# EAGLE schematic main controler-old (EAGLE 9.4.2)
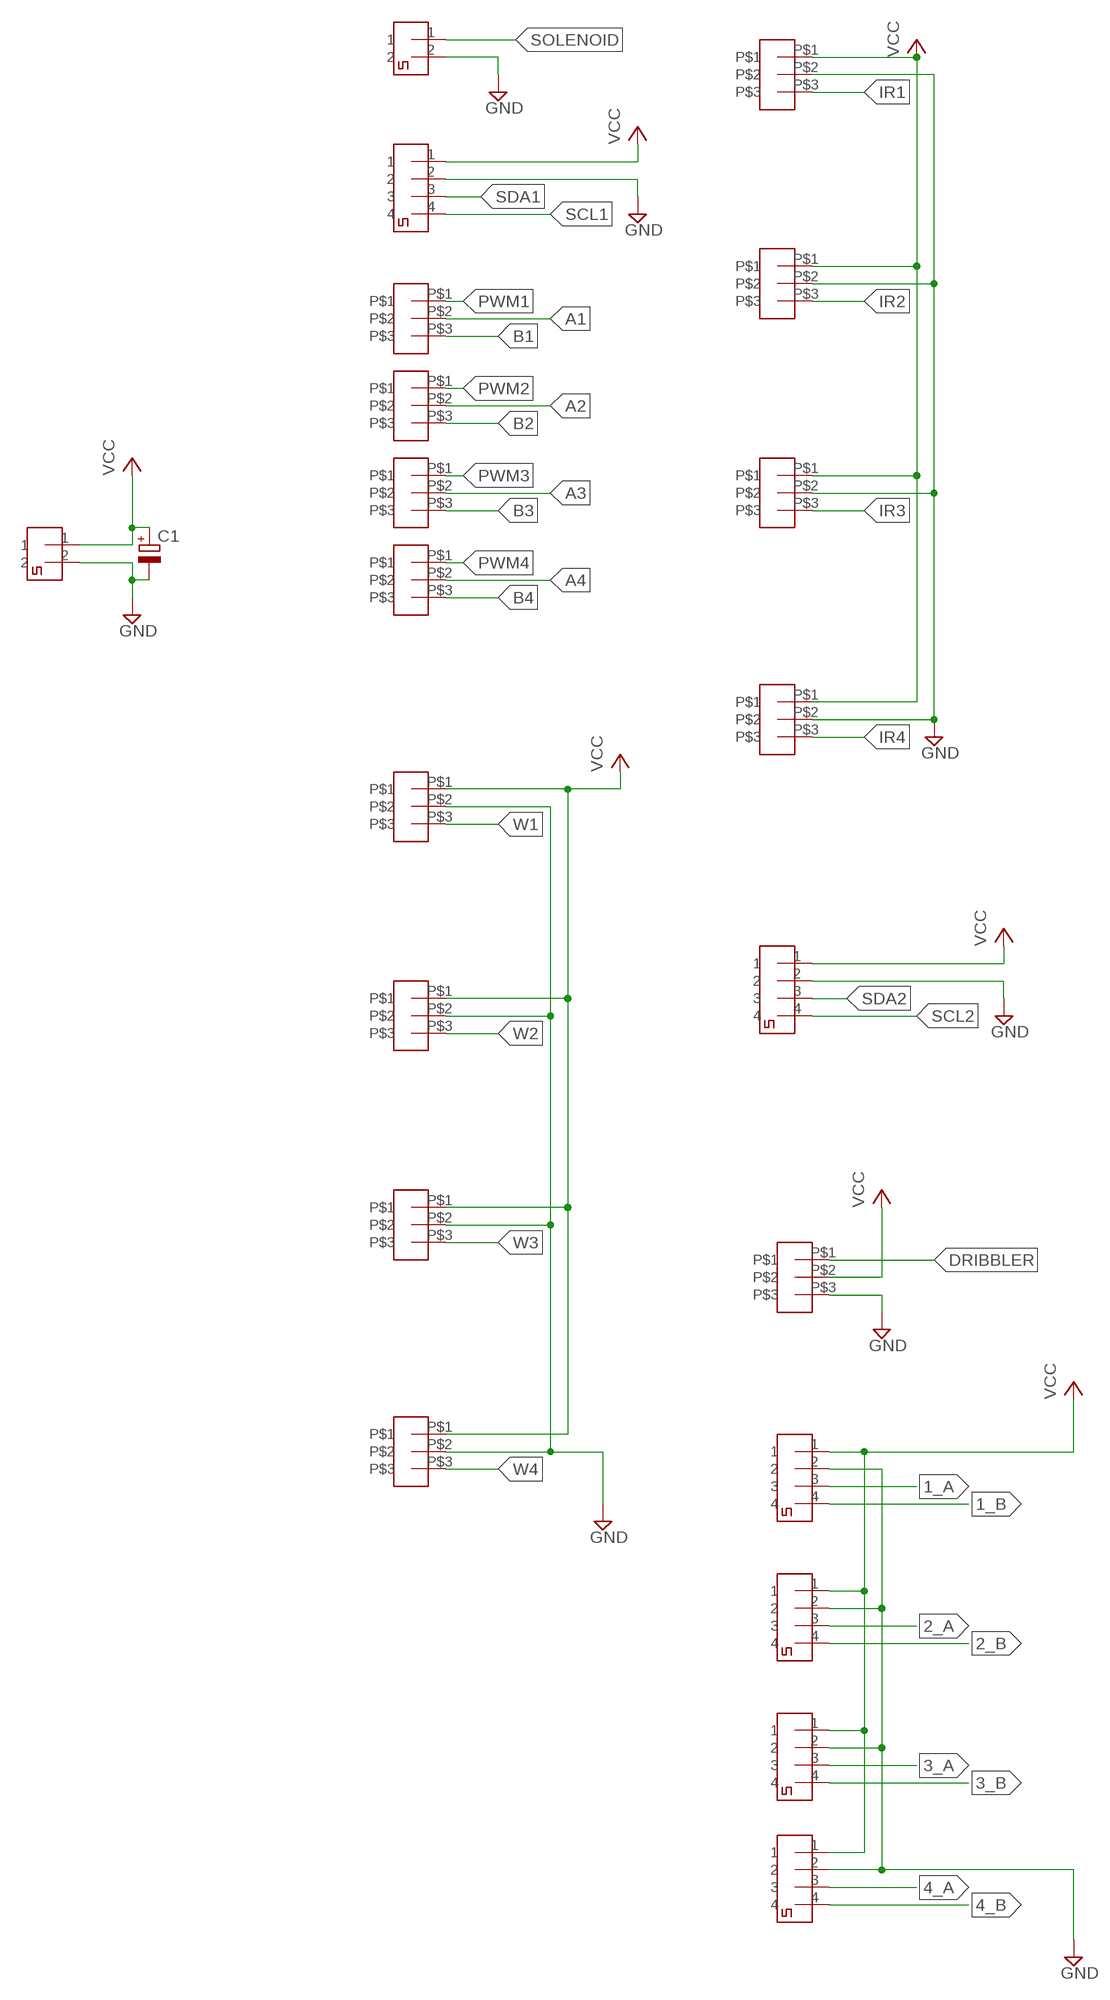
[diagram p0: schematic, sheet 1, part 1 of 2]
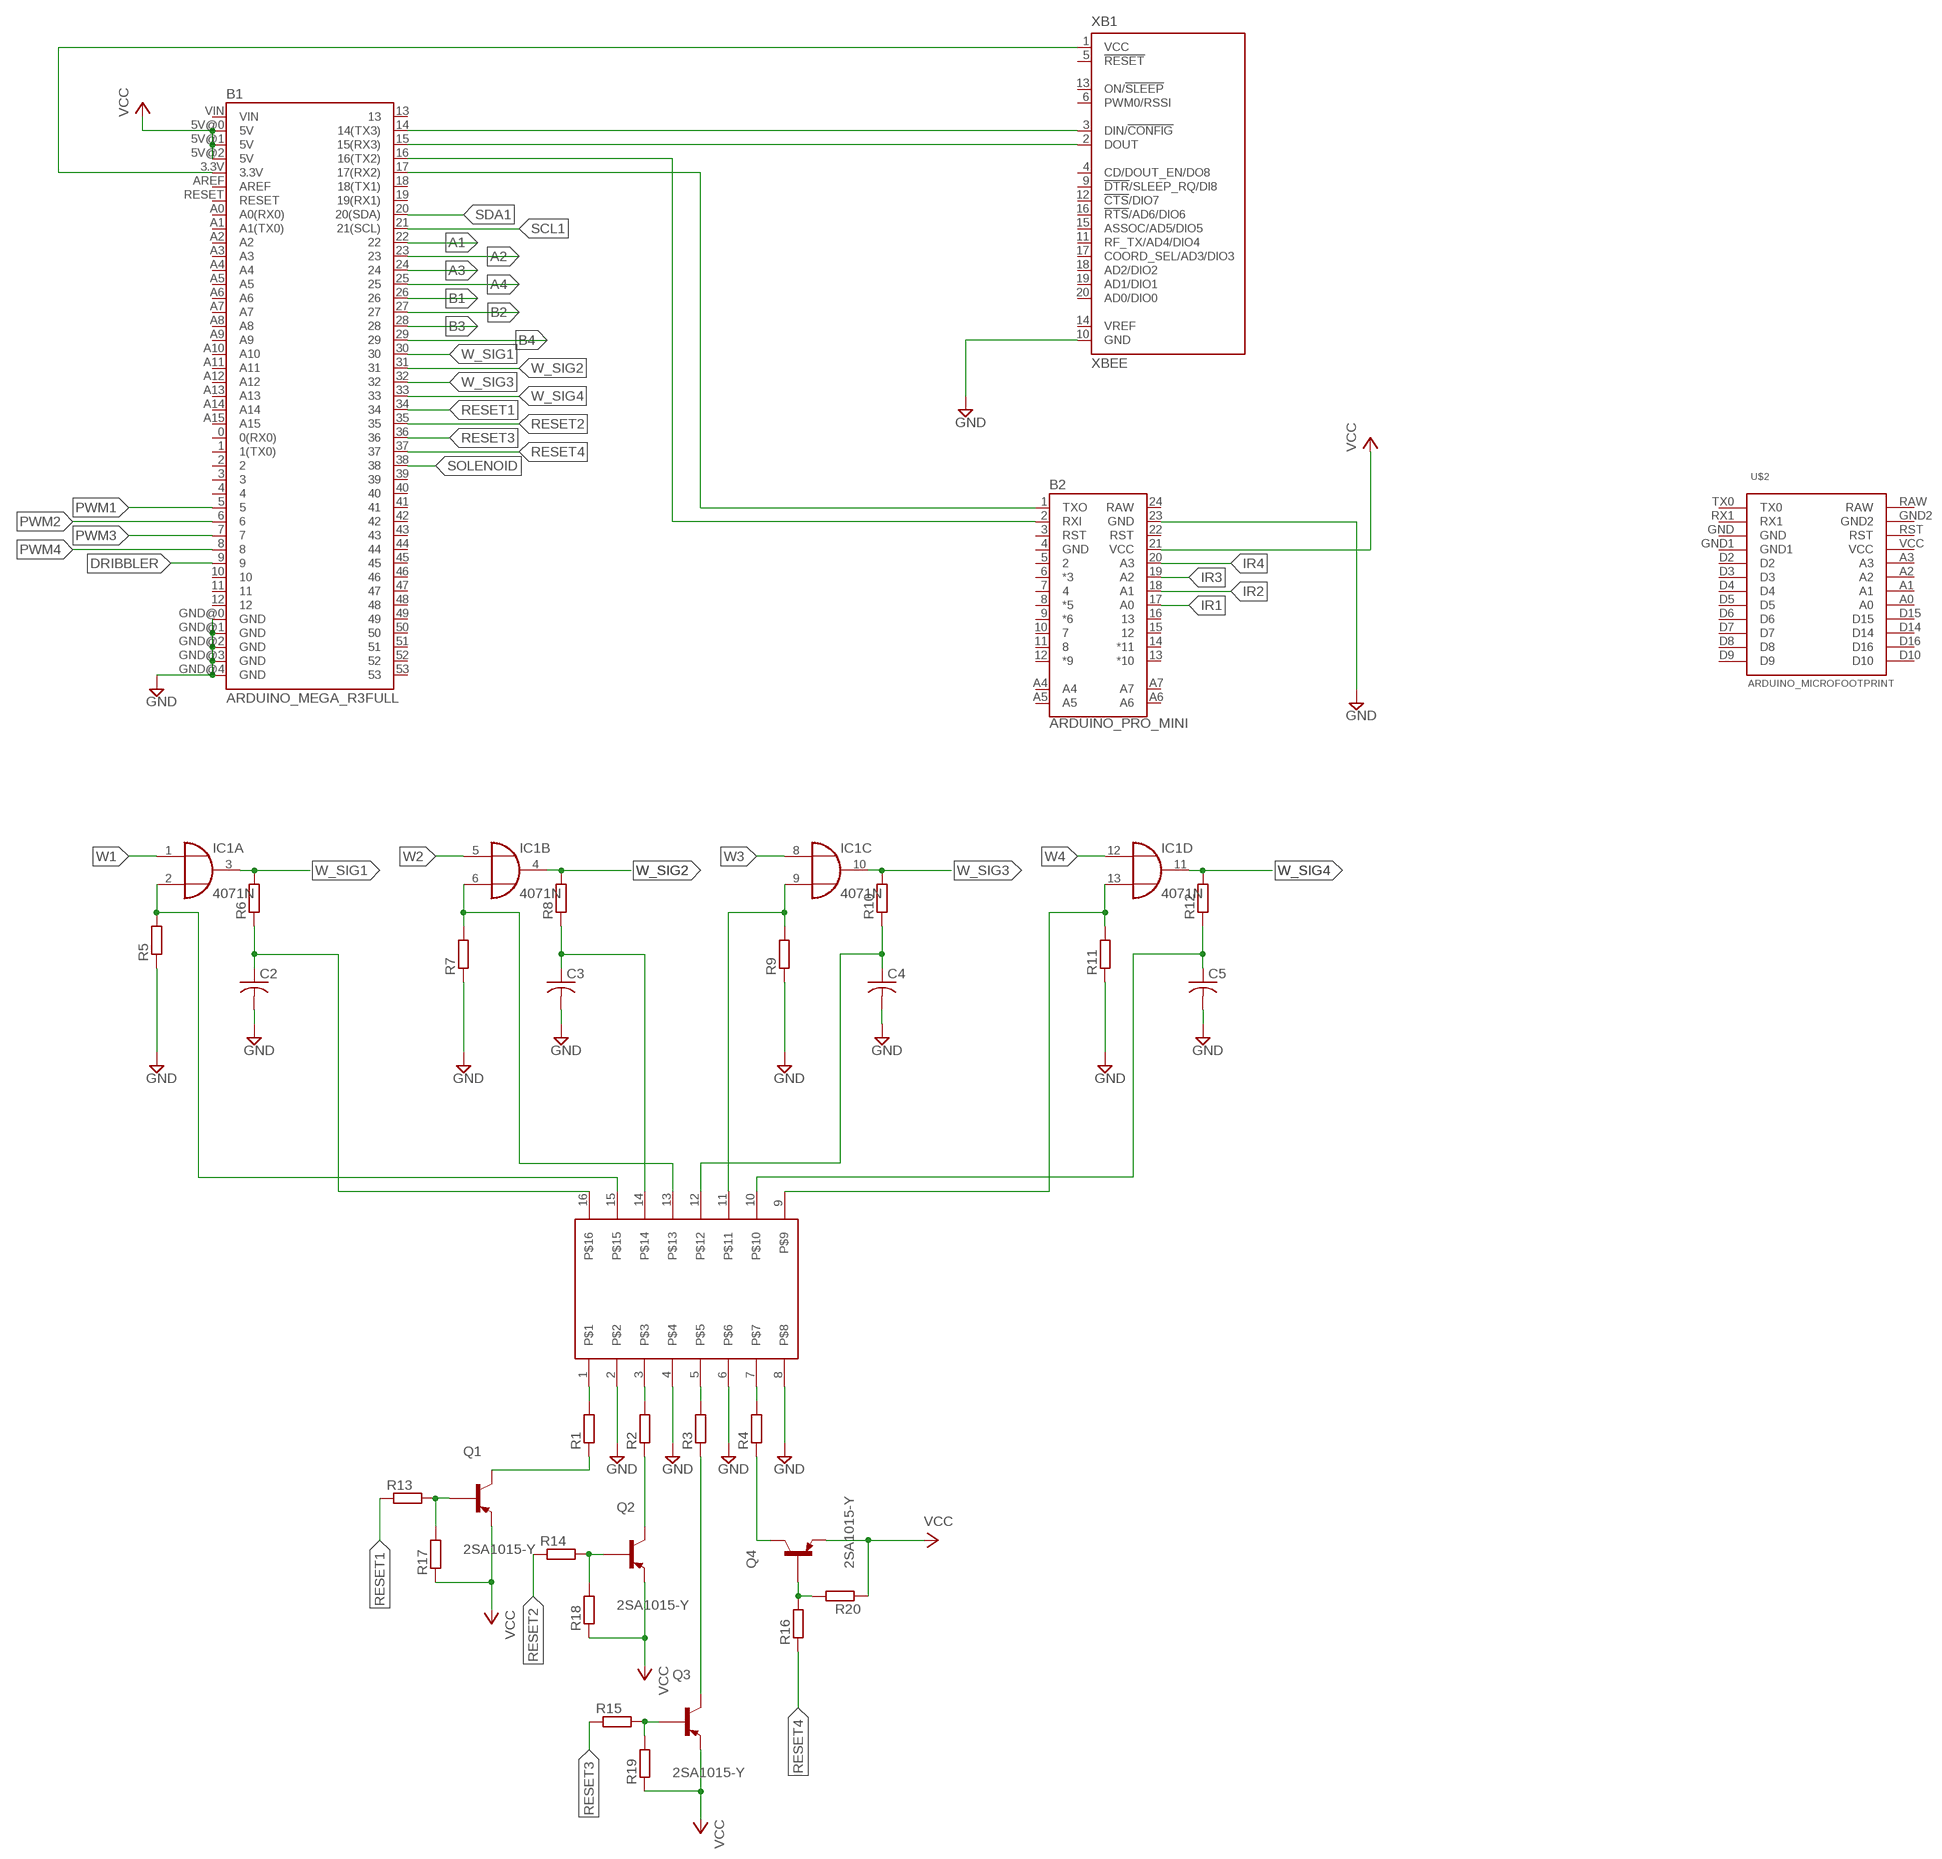
[diagram p1: schematic, sheet 1, part 2 of 2]

## Parts
5V_IN  2PIN  [2PIN]
B1  ARDUINO_MEGA_R3FULL  [ARDUINO_MEGA]
B2  ARDUINO_PRO_MINI  [ARDUINO_PRO_MINI]
C1  CPOL-EUE2-5  [E2-5]
C2  C-US050-024X044  [C050-024X044]
C3  C-US050-024X044  [C050-024X044]
C4  C-US050-024X044  [C050-024X044]
C5  C-US050-024X044  [C050-024X044]
CONNECTOR2  2PIN  [2PIN]
DRIBBLER  3PIN  [3PIN]
ENCODER1  2PIN  [2PIN]
ENCODER2  2PIN  [2PIN]
ENCODER3  2PIN  [2PIN]
ENCODER4  2PIN  [2PIN]
I2C_MEGA  2PIN  [2PIN]
IC1  4071N  [DIL14]
IR_DISTANCE1  3PIN  [3PIN]
IR_DISTANCE2  3PIN  [3PIN]
IR_DISTANCE3  3PIN  [3PIN]
IR_DISTANCE4  3PIN  [3PIN]
MOTOR1  3PIN  [3PIN]
MOTOR2  3PIN  [3PIN]
MOTOR3  3PIN  [3PIN]
MOTOR4  3PIN  [3PIN]
Q1  2SA1015-Y  [TO92127P510H650-3]
Q2  2SA1015-Y  [TO92127P510H650-3]
Q3  2SA1015-Y  [TO92127P510H650-3]
Q4  2SA1015-Y  [TO92127P510H650-3]
R1  R-EU_0204/7  [0204/7]
R2  R-EU_0204/7  [0204/7]
R3  R-EU_0204/7  [0204/7]
R4  R-EU_0204/7  [0204/7]
R5  R-EU_0204/7  [0204/7]
R6  R-EU_0204/7  [0204/7]
R7  R-EU_0204/7  [0204/7]
R8  R-EU_0204/7  [0204/7]
R9  R-EU_0204/7  [0204/7]
R10  R-EU_0204/7  [0204/7]
R11  R-EU_0204/7  [0204/7]
R12  R-EU_0204/7  [0204/7]
R13  R-EU_0204/7  [0204/7]
R14  R-EU_0204/7  [0204/7]
R15  R-EU_0204/7  [0204/7]
R16  R-EU_0204/7  [0204/7]
R17  R-EU_0204/7  [0204/7]
R18  R-EU_0204/7  [0204/7]
R19  R-EU_0204/7  [0204/7]
R20  R-EU_0204/7  [0204/7]
SOLENOID  2PIN  [2PIN]
U$1  TLP627-4  [DIP254P762X432-16P]
U$2  ARDUINO_MICROFOOTPRINT  [ARDUINO-MICRO]
WHITE1  3PIN  [3PIN]
WHITE2  3PIN  [3PIN]
WHITE3  3PIN  [3PIN]
WHITE4  3PIN  [3PIN]
XB1  XBEE  [XBEE]

## Nets
1_A: ENCODER1.3
1_B: ENCODER1.4
2_A: ENCODER2.3
2_B: ENCODER2.4
3_A: ENCODER3.3
3_B: ENCODER3.4
4_A: ENCODER4.3
4_B: ENCODER4.4
A1: B1.22 MOTOR1.P$2
A2: B1.23 MOTOR2.P$2
A3: B1.24 MOTOR3.P$2
A4: B1.25 MOTOR4.P$2
B1: B1.26 MOTOR1.P$3
B2: B1.27 MOTOR2.P$3
B3: B1.28 MOTOR3.P$3
B4: B1.29 MOTOR4.P$3
DRIBBLER: B1.9 DRIBBLER.P$1
GND: 5V_IN.2 B1.GND@0(GND) B1.GND@1(GND) B1.GND@2(GND) B1.GND@3(GND) B1.GND@4(GND) B2.23(GND) C1.- C2.2 C3.2 C4.2 C5.2 CONNECTOR2.2 DRIBBLER.P$3 ENCODER1.2 ENCODER2.2 ENCODER3.2 ENCODER4.2 I2C_MEGA.2 IR_DISTANCE1.P$2 IR_DISTANCE2.P$2 IR_DISTANCE3.P$2 IR_DISTANCE4.P$2 R5.1 R7.1 R9.1 R11.1 SOLENOID.2 U$1.2 U$1.4 U$1.6 U$1.8 WHITE1.P$2 WHITE2.P$2 WHITE3.P$2 WHITE4.P$2 XB1.10(GND)
IR1: B2.17(A0) IR_DISTANCE1.P$3
IR2: B2.18(A1) IR_DISTANCE2.P$3
IR3: B2.19(A2) IR_DISTANCE3.P$3
IR4: B2.20(A3) IR_DISTANCE4.P$3
N$1: B1.3.3V XB1.1(VCC)
N$2: B1.15(15(RX3)) XB1.2(DOUT)
N$3: B1.17(17(RX2)) B2.1(TXO)
N$4: B1.16(16(TX2)) B2.2(RXI)
N$5: B1.14(14(TX3)) XB1.3(DIN/!CONFIG)
N$8: IC1.2(A:I1) R5.2 U$1.15
N$9: IC1.6(B:I1) R7.2 U$1.13
N$10: C3.1 R8.1 U$1.14
N$11: C2.1 R6.1 U$1.16
N$12: C4.1 R10.1 U$1.12
N$14: IC1.9(C:I1) R9.2 U$1.11
N$15: IC1.13(D:I1) R11.2 U$1.9
N$17: C5.1 R12.1 U$1.10
N$18: Q1.2(C) R1.1
N$19: Q2.2(C) R2.1
N$20: R1.2 U$1.1
N$21: R2.2 U$1.3
N$22: R4.2 U$1.7
N$23: R3.2 U$1.5
N$24: Q3.2(C) R3.1
N$25: Q4.2(C) R4.1
N$26: Q1.3(B) R13.2 R17.2
N$27: Q2.3(B) R14.2 R18.2
N$28: Q4.3(B) R16.2 R20.2
N$29: Q3.3(B) R15.2 R19.2
PWM1: B1.5 MOTOR1.P$1
PWM2: B1.6 MOTOR2.P$1
PWM3: B1.7 MOTOR3.P$1
PWM4: B1.8 MOTOR4.P$1
RESET1: B1.34 R13.1
RESET2: B1.35 R14.1
RESET3: B1.36 R15.1
RESET4: B1.37 R16.1
SCL1: B1.21(21(SCL)) I2C_MEGA.4
SCL2: CONNECTOR2.4
SDA1: B1.20(20(SDA)) I2C_MEGA.3
SDA2: CONNECTOR2.3
SOLENOID: B1.38 SOLENOID.1
VCC: 5V_IN.1 B1.5V@0(5V) B1.5V@1(5V) B1.5V@2(5V) B2.21(VCC) C1.+ CONNECTOR2.1 DRIBBLER.P$2 ENCODER1.1 ENCODER2.1 ENCODER3.1 ENCODER4.1 I2C_MEGA.1 IR_DISTANCE1.P$1 IR_DISTANCE2.P$1 IR_DISTANCE3.P$1 IR_DISTANCE4.P$1 Q1.1(E) Q2.1(E) Q3.1(E) Q4.1(E) R17.1 R18.1 R19.1 R20.1 WHITE1.P$1 WHITE2.P$1 WHITE3.P$1 WHITE4.P$1
W1: IC1.1(A:I0) WHITE1.P$3
W2: IC1.5(B:I0) WHITE2.P$3
W3: IC1.8(C:I0) WHITE3.P$3
W4: IC1.12(D:I0) WHITE4.P$3
W_SIG1: B1.30 IC1.3(A:O) R6.2
W_SIG2: B1.31 IC1.4(B:O) R8.2
W_SIG3: B1.32 IC1.10(C:O) R10.2
W_SIG4: B1.33 IC1.11(D:O) R12.2
Unconnected: B1.0(0(RX0)) B1.1(1(TX0)) B1.2 B1.3 B1.4 B1.10 B1.11 B1.12 B1.13 B1.18(18(TX1)) B1.19(19(RX1)) B1.39 B1.40 B1.41 B1.42 B1.43 B1.44 B1.45 B1.46 B1.47 B1.48 B1.49 B1.50 B1.51 B1.52 B1.53 B1.A0(A0(RX0)) B1.A1(A1(TX0)) B1.A2 B1.A3 B1.A4 B1.A5 B1.A6 B1.A7 B1.A8 B1.A9 B1.A10 B1.A11 B1.A12 B1.A13 B1.A14 B1.A15 B1.AREF B1.RESET B1.VIN B2.3(RST) B2.5 B2.6(*3) B2.7 B2.8(*5) B2.9(*6) B2.10 B2.11 B2.12(*9) B2.13(*10) B2.14(*11) B2.15 B2.16 B2.22(RST) B2.A4 B2.A5 B2.A6 B2.A7 U$2.A0 U$2.A1 U$2.A2 U$2.A3 U$2.D2 U$2.D3 U$2.D4 U$2.D5 U$2.D6 U$2.D7 U$2.D8 U$2.D9 U$2.D10 U$2.D14 U$2.D15 U$2.D16 U$2.GND U$2.GND1 U$2.GND2 U$2.RAW U$2.RST U$2.RX1 U$2.TX0 U$2.VCC XB1.4(CD/DOUT_EN/DO8) XB1.5(!RESET) XB1.6(PWM0/RSSI) XB1.9(!DTR!/SLEEP_RQ/DI8) XB1.11(RF_TX/AD4/DIO4) XB1.12(!CTS!/DIO7) XB1.13(ON/!SLEEP) XB1.14(VREF) XB1.15(ASSOC/AD5/DIO5) XB1.16(!RTS!/AD6/DIO6) XB1.17(COORD_SEL/AD3/DIO3) XB1.18(AD2/DIO2) XB1.19(AD1/DIO1) XB1.20(AD0/DIO0)

## Power pins joined to a net without a drawn wire
GND: B2.4(GND)
RAW: B2.24(RAW)
VDD: IC1.14(P:VDD)
VSS: IC1.7(P:VSS)

## Library data of the parts
5V_IN SOLENOID = 2pin_small:2PIN: 2pin
B1 = Arduino:ARDUINO_MEGA_R3: Arduino Mega R3 ATmega2560 R3 compatible footprint. SparkFun Products: Arduino Mega 2560 R3 <https://www.sparkfun.com/products/11061>
B2 = Arduino:ARDUINO_PRO_MINI: SparkFun Pro Mini Pro Mini compatible footprint. Dimensions: 0.7 x 1.3" PCB Thickness: 0.8mm SparkFun Products: 3.3V/8MHz <https://www.sparkfun.com/products/11114> 5V/16MHz <https://www.sparkfun.com/products/11113>
C1 = rcl:CPOL-EU: POLARIZED CAPACITOR, European symbol; SPICEPREFIX: C
C2-C5 = rcl:C-US: CAPACITOR, American symbol; SPICEPREFIX: C
CONNECTOR2 ENCODER1-ENCODER4 I2C_MEGA = 4pin_small:2PIN: 2pin
DRIBBLER IR_DISTANCE1-IR_DISTANCE4 MOTOR1-MOTOR4 WHITE1-WHITE4 = 3PIN_2:3PIN
IC1 = 40xx:4071: Quad 2-input OR
Q1-Q4 = 2SA1015-Y:2SA1015-Y: Transistor PNP 2SA1015/2SA1015Y TOSHIBA miliampere=150 V=50 TO92; AVAILABILITY: Unavailable; DESCRIPTION: Transistor PNP 2SA1015/2SA1015Y TOSHIBA miliampere=150 V=50 TO92; MF: Toshiba; MP: 2SA1015-Y; PACKAGE: TO-92 Toshiba; PRICE: None
R1-R20 = rcl:R-EU_: RESISTOR, European symbol; SPICEPREFIX: R
U$1 = DIP254P762X432-16P:TLP627-4
U$2 = arduino-micro:ARDUINO_MICRO
XB1 = maxstream:XBEE: XBee (TM) /XBee-PRO(TM) OEM RF Modules Source: MaxStream, Inc. xbee_productmanual.pdf; MPN: XBP24-Z7UIT-004; OC_FARNELL: 1751799; OC_NEWARK: 34R5507